# EasyEDA Pro project ProProject_XIAO_NRF52833_2024-01-15.epro, schematic Schematic3
Create Date: 2023-09-14; Page Name: P1; Project Name: XIAO_NRF52833; Schematic Name: Schematic3; Update Date: 2023-09-20; Company: EasyEDA.com; Drawed: EasyEDA Pro; Page Size: A4; Part Number: JLCPCB-002; Reviewed: EasyEDA Pro; Version: V0.1
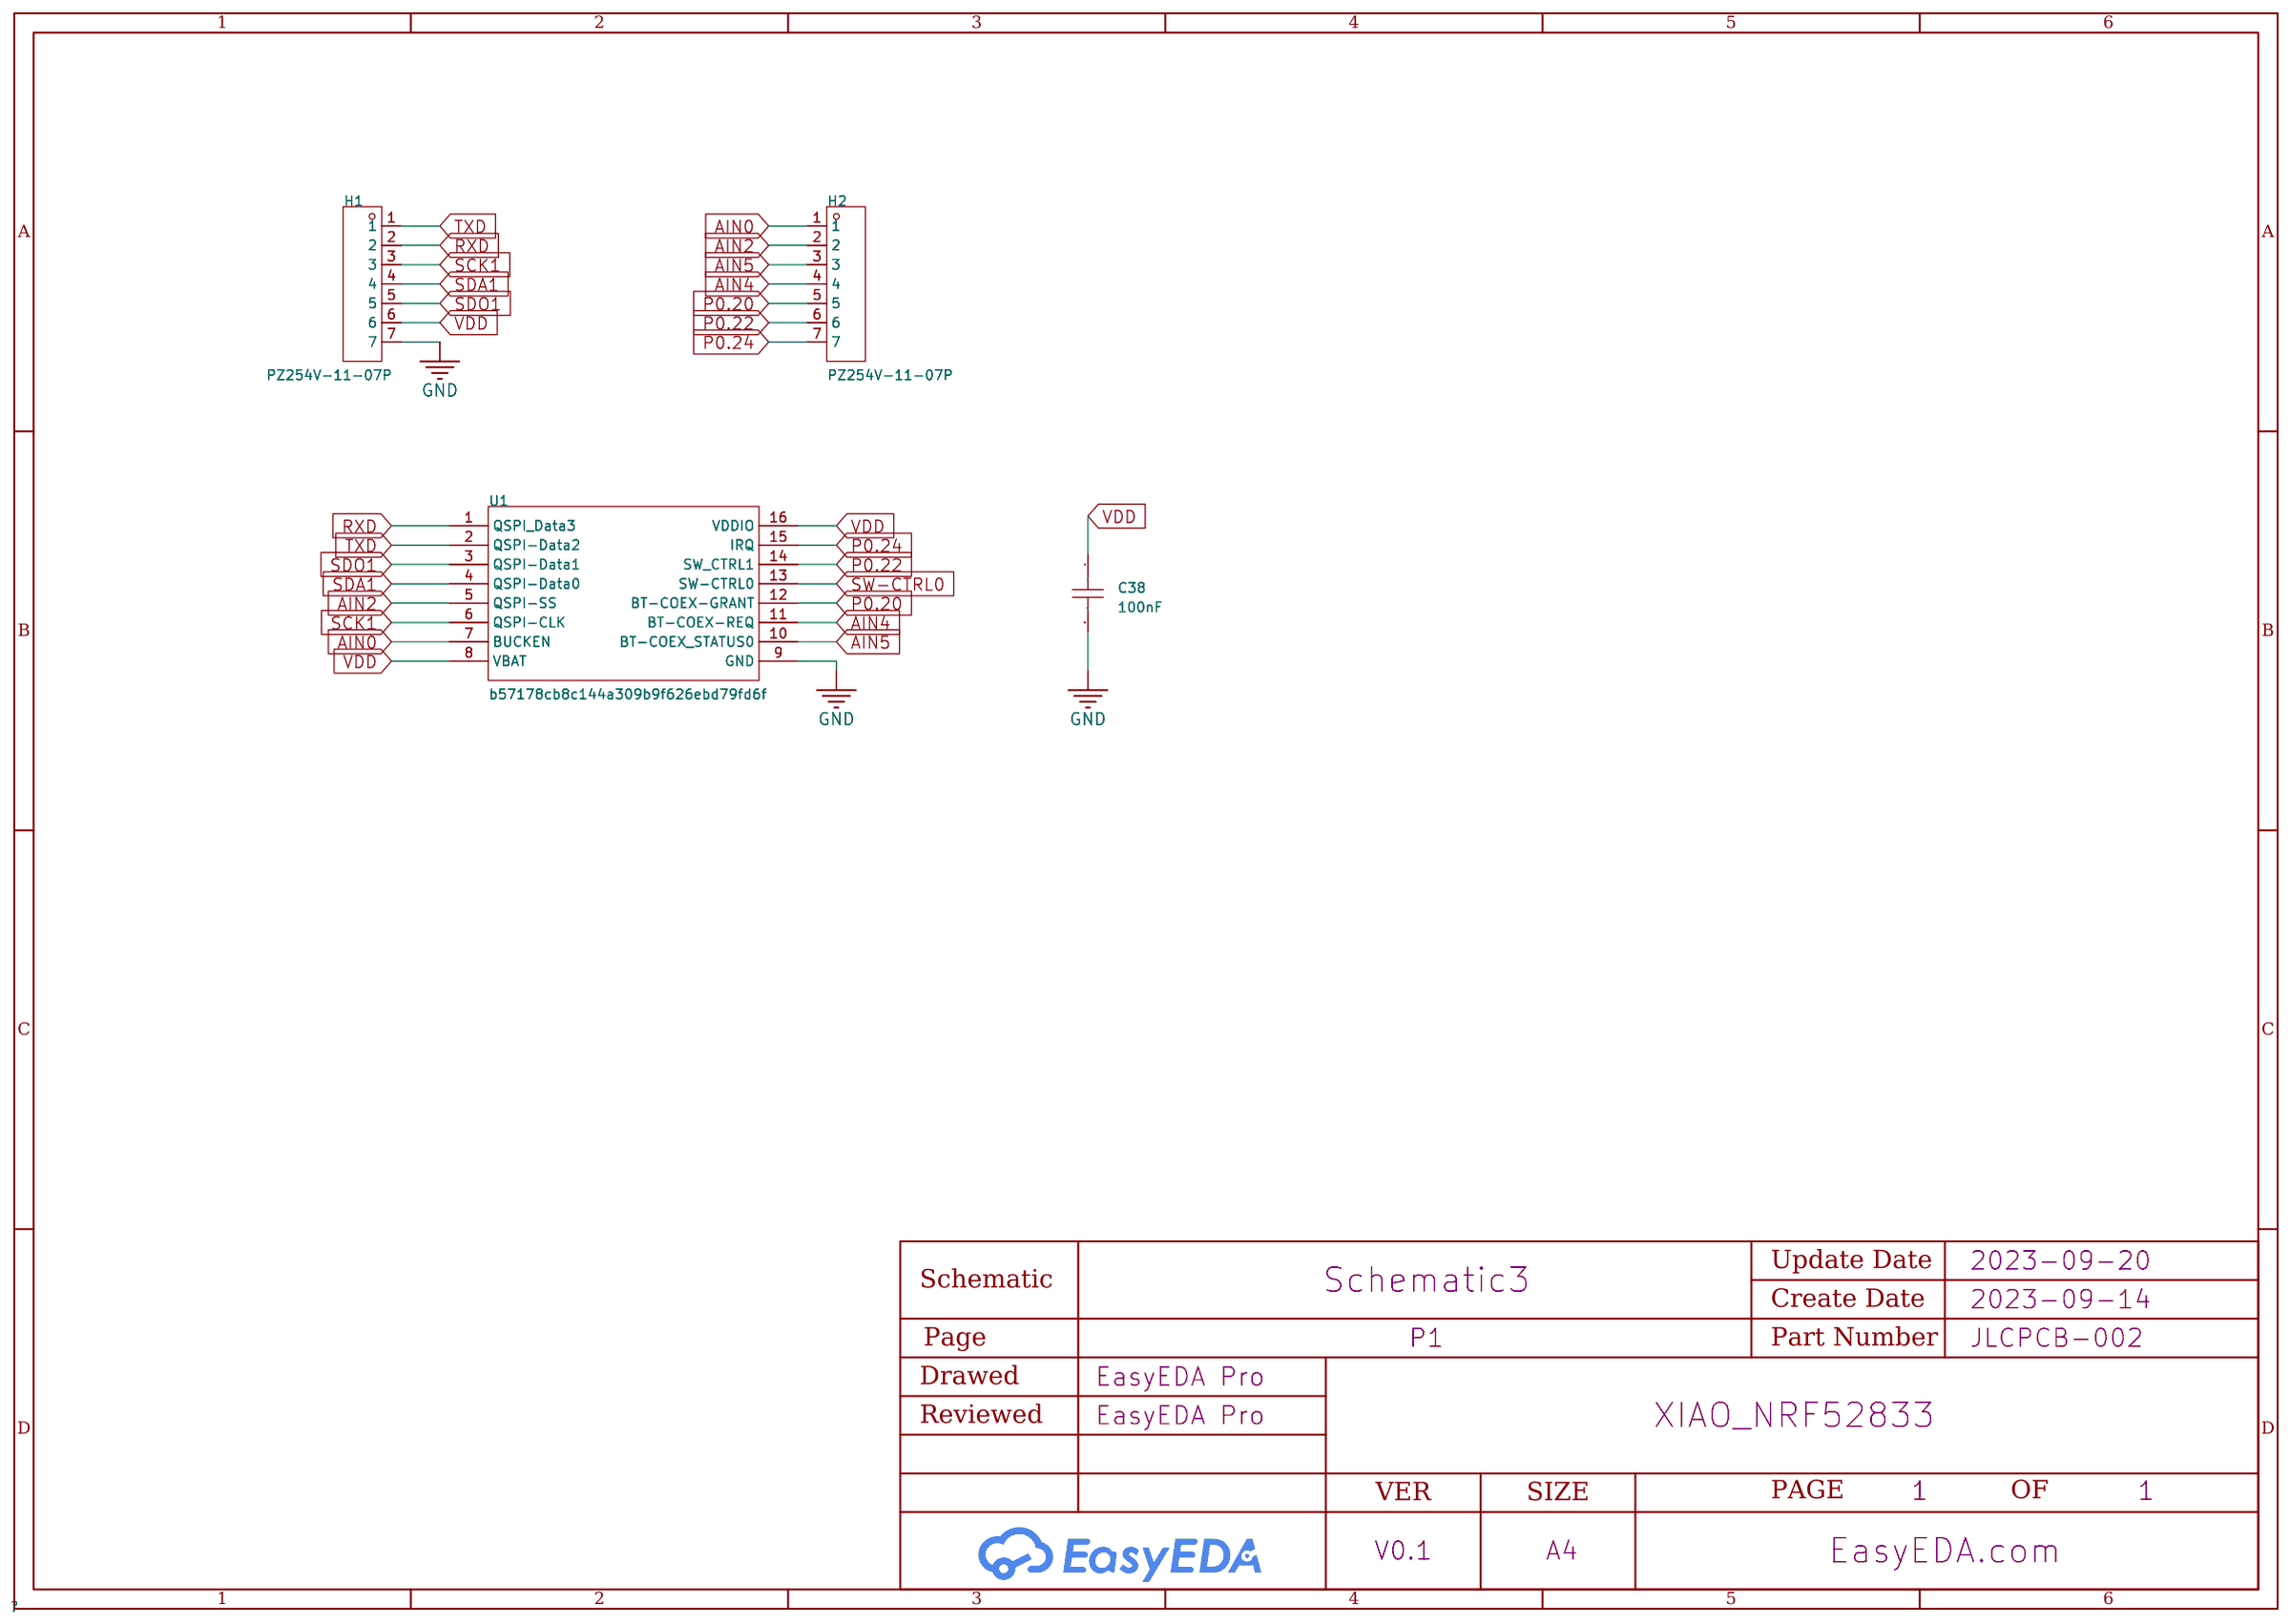
[diagram p0: schematic sheet]

## Parts
C38  100nF  [C0201]
H1  PZ254V-11-07P  [HDR-TH_7P-P2.54-V-M]  (no BOM)
H2  PZ254V-11-07P  [HDR-TH_7P-P2.54-V-M]  (no BOM)
U1  b57178cb8c144a309b9f626ebd79fd6f  [WM02C]

## Library data of the parts
C38 = CL03A104KQ3NNNC: Capacitance: Tolerance:±10% Tolerance:±10% Voltage Rated: Temperature Coefficient:; LCSC Part Name: 100nF ±10% 6.3V; Supplier Part: C160831; Manufacturer: SAMSUNG(三星); Supplier Footprint: 0201; JLCPCB Part Class: Extended Part; Datasheet: https://atta.szlcsc.com/upload/public/pdf/source/20171228/C160831_15144412250661213800.pdf; Supplier: LCSC; Tolerance: ±10%
H1 H2 = PZ254V-11-07P: Number of Rows:Plugin Number of Pins:7P Pitch:2.54mm Pin Structure:1x7P Row Spacing:- Mounting Type:Straight Circluar Pins/Square Pins:Square Pins Current Rating (Max):- Voltage Rating (Max):- Length of Mating Pin:6mm Insulation Height:2.5mm Length of End; LCSC Part Name: 2.54mm 1x7P 直插 方针; Supplier Part: C492406; Manufacturer: XFCN(兴飞); Supplier Footprint: 插件,P=2.54mm; JLCPCB Part Class: Extended Part; Datasheet: https://atta.szlcsc.com/upload/public/pdf/source/20200309/C492406_654C533EE691117E22DD9F76C114C2D9.pdf; Supplier: LCSC; Number of Rows: Plugin; Number of Pins: 7P; Pitch: 2.54mm; Pin Structure: 1x7P; Mounting Type: Straight; Circluar Pins/Square Pins: Square Pins; Length of Mating Pin: 6mm; Insulation Height: 2.5mm; Length of End Connection Pin: 3mm; Operating Temperature Range: -40℃~+105℃; Color: Black
U1 = WM02C: Fanstel WiFi6 Module

## Nets
GND: C38.2 H1.7 U1.9(GND)
VDD: C38.1 H1.6 U1.8(VBAT) U1.16(VDDIO)
AIN0: H2.1 U1.7(BUCKEN)
AIN2: H2.2 U1.5(QSPI-SS)
AIN4: H2.4 U1.11(BT-COEX-REQ)
AIN5: H2.3 U1.10(BT-COEX_STATUS0)
P0.20: H2.5 U1.12(BT-COEX-GRANT)
P0.22: H2.6 U1.14(SW_CTRL1)
P0.24: H2.7 U1.15(IRQ)
RXD: H1.2 U1.1(QSPI_Data3)
SCK1: H1.3 U1.6(QSPI-CLK)
SDA1: H1.4 U1.4(QSPI-Data0)
SDO1: H1.5 U1.3(QSPI-Data1)
SW-CTRL0: U1.13(SW-CTRL0)
TXD: H1.1 U1.2(QSPI-Data2)
